# Altium project DCAV32_WINGLET_V1P_OSR.PrjPcb (part 1 of 3)
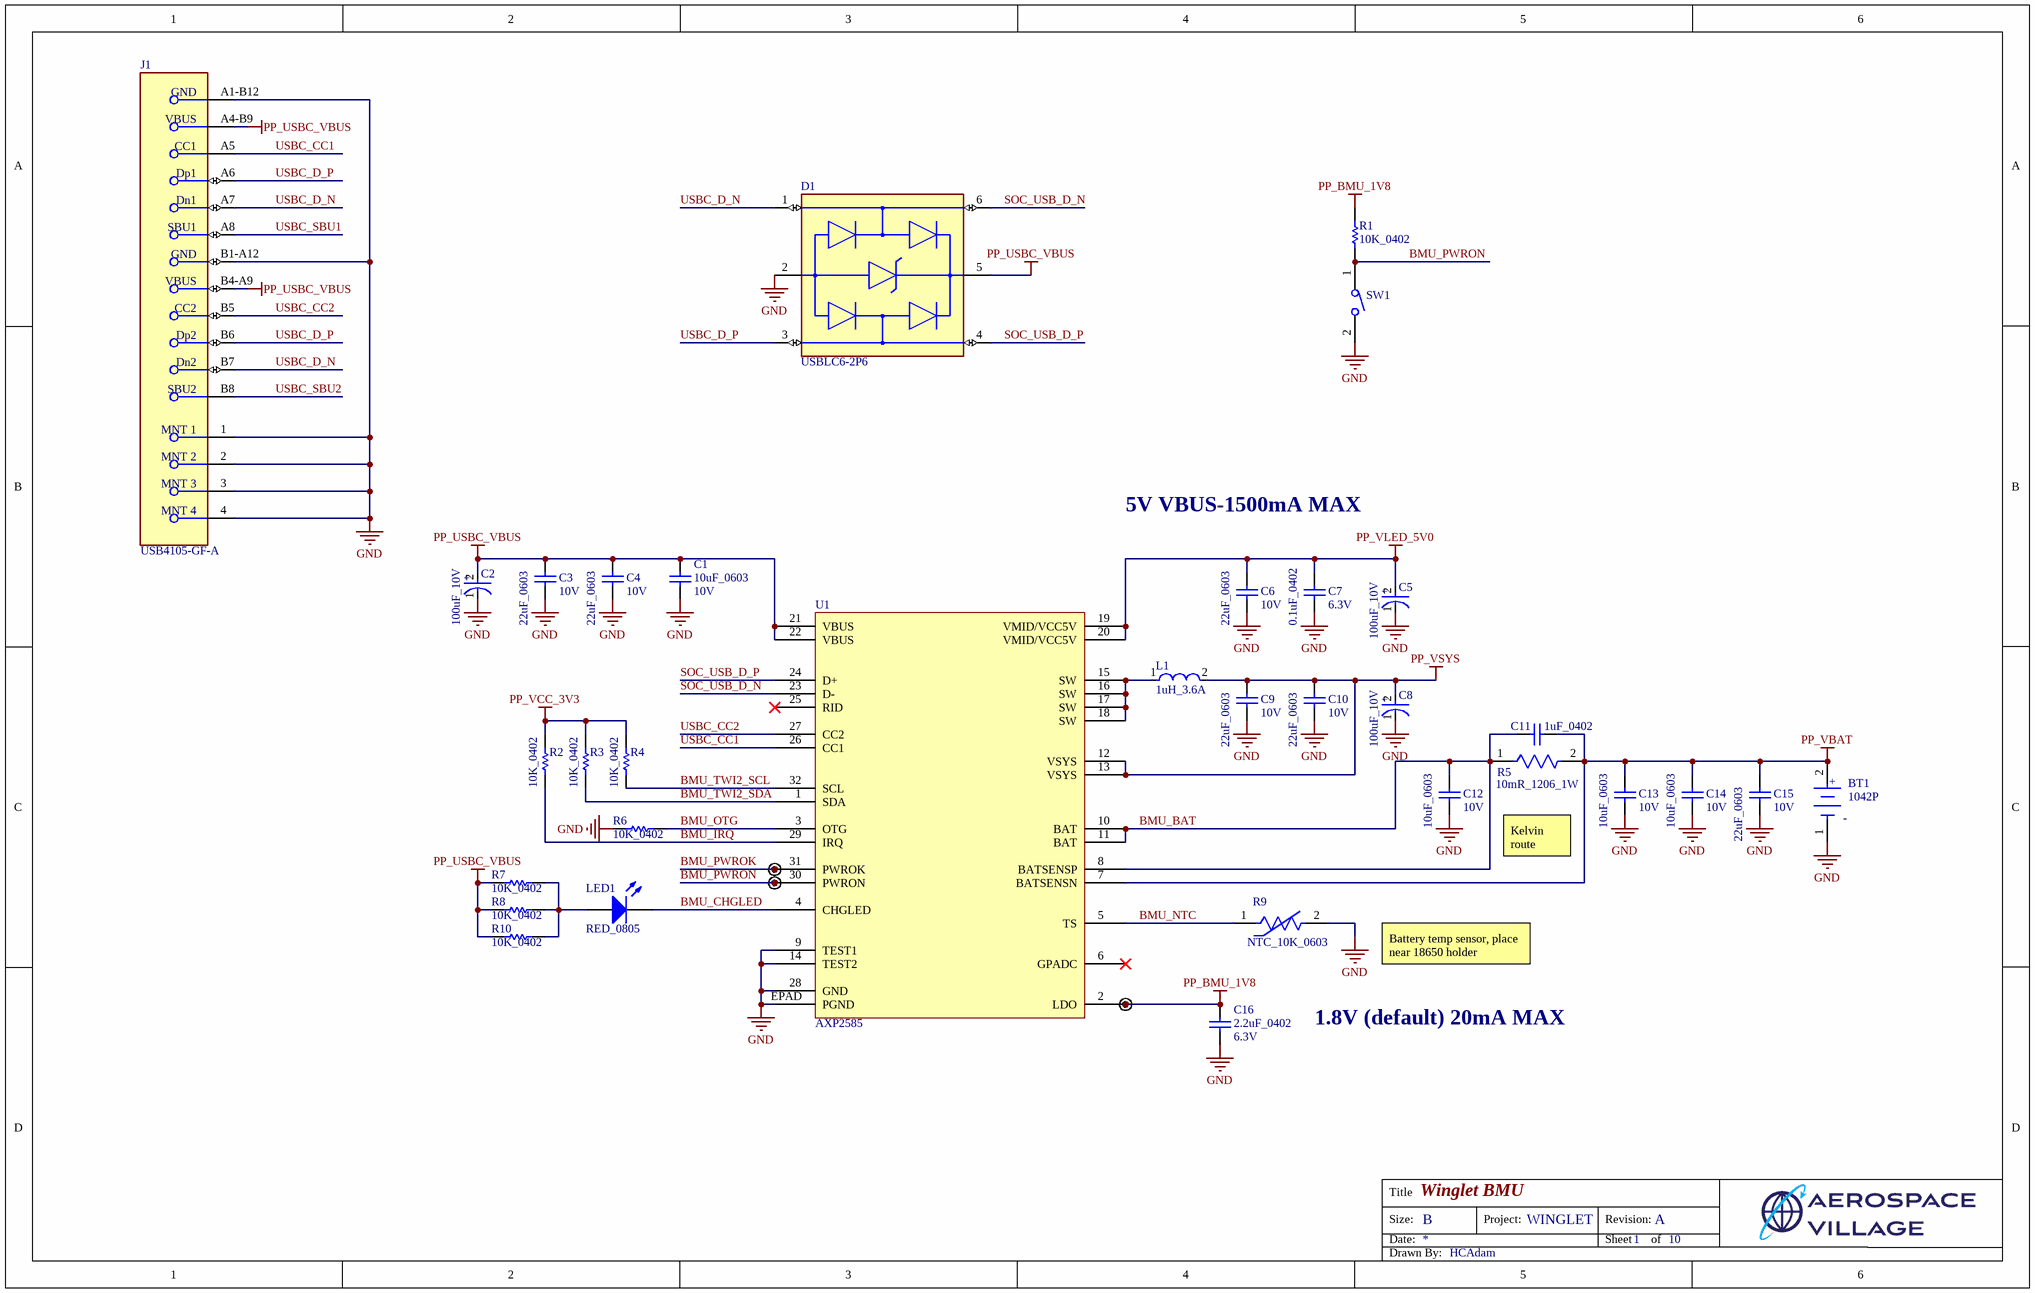
[diagram p0: SCH_WINGLET_BMU.SchDoc]
10 sheets, 401 parts. Net scope: global (net labels, ports and power ports of the same name join across sheets).
Board file: PCB_WINGLET_V1P_OSR.PcbDoc
Sheets:
  SCH_WINGLET_BMU.SchDoc
  SCH_WINGLET_PWR.SchDoc
  SCH_WINGLET_SOC.SchDoc
  SCH_WINGLET_SD_MMC.SchDoc
  SCH_WINGLET_DISP.SchDoc
  SCH_WINGLET_WIFI.SchDoc
  SCH_WINGLET_GNSS.SchDoc
  SCH_WINGLET_ADSB.SchDoc
  SCH_WINGLET_IO.SchDoc
  SCH_WINGLET_DEBUG.SchDoc

## Sheet SCH_WINGLET_BMU.SchDoc: Winglet BMU
size B; DrawnBy: HCAdam; Organization: Aerospace Village; DocumentNumber: WINGLET; Revision: A; SheetNumber: 1; SheetTotal: 10

### Parts
BT1  1042P  [FP-1042P-MFG]
C1  10uF_0603  Voltage Rating: 10V  [CAPC1609X100X15NL20]
C2  100uF_10V  [FP-TAJB-MFG]
C3  22uF_0603  Voltage Rating: 10V  [CAPC1608X100X20NL10]
C4  22uF_0603  Voltage Rating: 10V  [CAPC1608X100X20NL10]
C5  100uF_10V  [FP-TAJB-MFG]
C6  22uF_0603  Voltage Rating: 10V  [CAPC1608X100X20NL10]
C7  0.1uF_0402  Voltage Rating: 6.3V  [CAPC1005X56X25NL10T15]
C8  100uF_10V  [FP-TAJB-MFG]
C9  22uF_0603  Voltage Rating: 10V  [CAPC1608X100X20NL10]
C10  22uF_0603  Voltage Rating: 10V  [CAPC1608X100X20NL10]
C11  1uF_0402  [CAPC1005X55X25NL5T10]
C12  10uF_0603  Voltage Rating: 10V  [CAPC1609X100X15NL20]
C13  10uF_0603  Voltage Rating: 10V  [CAPC1609X100X15NL20]
C14  10uF_0603  Voltage Rating: 10V  [CAPC1609X100X15NL20]
C15  22uF_0603  Voltage Rating: 10V  [CAPC1608X100X20NL10]
C16  2.2uF_0402  Voltage Rating: 6.3V  [CAPC1005X55X25NL05T10]
D1  USBLC6-2P6  [FP-SOT-666-MFG]
J1  USB4105-GF-A  [FP-USB4105-GF-A-MFG]
L1  1uH_3.6A  [FP-NRS5020-MFG]
LED1  RED_0805  [0805_A]
R1  10K_0402  [RESC1005X40X25NL05T05]
R2  10K_0402  [RESC1005X40X25NL05T05]
R3  10K_0402  [RESC1005X40X25NL05T05]
R4  10K_0402  [RESC1005X40X25NL05T05]
R5  10mR_1206_1W  [FP-ERJ8BW-IPC_B]
R6  10K_0402  [RESC1005X40X25NL05T05]
R7  10K_0402  [RESC1005X40X25NL05T05]
R8  10K_0402  [RESC1005X40X25NL05T05]
R9  NTC_10K_0603  [FP-ERTJ1-IPC_C]
R10  10K_0402  [RESC1005X40X25NL05T05]
SW1  GT-TC029B-H025-L1N  [LCSC_SMD_SW_SMALL]  (value not drawn)
TP1  TESTPOINT  [TESTPOINT-0.7MM-SINGLE-LAYER]  (value not drawn)  (no BOM)
TP2  TESTPOINT  [TESTPOINT-0.7MM-SINGLE-LAYER]  (value not drawn)  (no BOM)
TP3  TESTPOINT  [TESTPOINT-0.7MM-SINGLE-LAYER]  (value not drawn)  (no BOM)
U1  AXP2585  [QFN127P600-8N]

### Nets
GND: BT1.1(C) C1.1 C2.1(C) C3.1 C4.1 C5.1(C) C6.1 C7.1 C8.1(C) C9.1 C10.1 C12.1 C13.1 C14.1 C15.1 C16.1 D1.2(GND) J1.1(MNT_1) J1.2(MNT_2) J1.3(MNT_3) J1.4(MNT_4) J1.A1-B12(GND) J1.B1-A12(GND) R6.1 R9.2 SW1.2 U1.9(TEST1) U1.14(TEST2) U1.28(GND) U1.EPAD(PGND)
PP_BMU_1V8: C16.2 R1.1 TP3.1 U1.2(LDO)
PP_USBC_VBUS: C1.2 C2.2(A) C3.2 C4.2 D1.5(VBUS) J1.A4-B9(VBUS) J1.B4-A9(VBUS) R7.2 R8.2 R10.2 U1.21(VBUS) U1.22(VBUS)
PP_VBAT: BT1.2(A) C11.1 C13.2 C14.2 C15.2 R5.2 U1.7(BATSENSN)
PP_VCC_3V3: R2.1 R3.1 R4.1
PP_VLED_5V0: C5.2(A) C6.2 C7.2 U1.19(VMID/VCC5V) U1.20(VMID/VCC5V)
PP_VSYS: C8.2(A) C9.2 C10.2 L1.2 U1.12(VSYS) U1.13(VSYS)
BMU_BAT: C11.2 C12.2 R5.1 U1.8(BATSENSP) U1.10(BAT) U1.11(BAT)
BMU_CHGLED: LED1.1(K) U1.4(CHGLED)
BMU_IRQ: R2.2 U1.29(IRQ)
BMU_NTC: R9.1 U1.5(TS)
BMU_OTG: R6.2 U1.3(OTG)
BMU_PWROK: TP1.1 U1.31(PWROK)
BMU_PWRON: R1.2 SW1.1 TP2.1 U1.30(PWRON)
BMU_TWI2_SCL: R4.2 U1.32(SCL)
BMU_TWI2_SDA: R3.2 U1.1(SDA)
SOC_USB_D_N: D1.6(I/O1) U1.23(D-)
SOC_USB_D_P: D1.4(I/O2) U1.24(D+)
USBC_CC1: J1.A5(CC1) U1.26(CC1)
USBC_CC2: J1.B5(CC2) U1.27(CC2)
USBC_D_N: D1.1(I/O1) J1.A7(Dn1) J1.B7(Dn2)
USBC_D_P: D1.3(I/O2) J1.A6(Dp1) J1.B6(Dp2)
USBC_SBU1: J1.A8(SBU1)
USBC_SBU2: J1.B8(SBU2)
NetL1_1: L1.1 U1.15(SW) U1.16(SW) U1.17(SW) U1.18(SW)
NetLED1_2: LED1.2(A) R7.1 R8.1 R10.1

Not connected (* = marked no-connect by the designer): U1 6(GPADC)* 25(RID)*

### Notes on the sheet
- 5V VBUS-1500mA MAX
- Kelvin route
- Battery temp sensor, place near 18650 holder
- 1.8V (default) 20mA MAX
- Title
- Size:
- Date:
- B
- Project:
- Revision:
- Sheet
- of
- Drawn By:
- (in symbol CMP-04424-000366-1) +
- (in symbol CMP-19636-000019-1) +; -

### Library data of the parts
BT1 = CMP-19636-000019-1: BATTERY HOLDER 18650 SMD TAB; Number of Cells: 1; Max Operating Temperature: 145°C; Termination: SMD/SMT; Mount: Surface Mount; Min Operating Temperature: -50°C; Package Quantity: 200; Packaging: Tray; Lead Free: Lead Free
C1 C12-C14 = CMP-2006-00191-1: Part Number: TACL106M006XTA; Manufacturer: AVX Interconnect / Elco
C2 C5 C8 = CMP-04424-000366-1: 100uF 10V ±10% 1.7Ω SMD CASE-B (3528) Tantalum Capacitor; Voltage Rating (DC): 6.3V; ESR (Equivalent Series Resistance): 1.7R; Polarity: Polar; Leakage Current: 6.3uA; Height: 1.9mm; Depth: 2.8mm; Length: 3.5mm; Min Operating Temperature: -55°C; Width: 2.8mm; Series: TAJ; Lead Free: Lead Free; Case/Package: 1210; Voltage: 6.3V; Mount: Surface Mount; Tolerance: 10%; Capacitance: 100uF; Radiation Hardening: No; REACH SVHC: No SVHC; Voltage Rating: 6.3V; Case Code (Metric): 3528; Dissipation Factor: 10%; Packaging: Tape and Reel; Construction: Flat; Features: General Purpose; Max Operating Temperature: 125°C; RoHS Compliant: Yes; Package Quantity: 1; Dielectric Material: Tantalum; Termination: SMD/SMT; Case Code (Imperial): 1210; Height - Seated (Max): 0.083inch
C3 C4 C6 C9 C10 C15 = CMP-2000-05441-1: Chip Capacitor, 22 uF, +/- 20%, 10 V, -55 to 85 degC, 0603 (1608 Metric), RoHS, Tape and Reel / PN: C1608X5R1A226M080AC; Manufacturer: TDK; PCN Part Number: MLCCPartNumberChange30/Nov/2012; Product Training Modules: CSeriesGeneralApplicationsSEAT,CCV,andTVCLDesignToolsGuidetoReplacinganElectrolyticCapacitorwithanMLCC; Other Names: 445-9077-1; Design Resources: 20WNon-IsolatedBuckLEDDriverUsingPLLNK460KG; Online Catalog: CSeries,GeneralPurpose; Capacitance: 22µF; Temperature Coefficient: X5R; Kits: 445-9014-KIT-ND-KITMLCC100PF-22UF060310-50V; Packaging: CutTape(CT); Standard Package: 1; Package / Case: 0603(1608Metric); Lead Style: -; Features: -; Ratings: -; Voltage - Rated: 10V; Operating Temperature: -55degC~85degC; Applications: GeneralPurpose; Package Reference: 603; Datasheet URL: http://download.siliconexpert.com/pdfs/2015/4/21/15/54/45/779/tdk_/manual/37024850441143360mlcc_commercial_general_en.pdf; Datasheet Version: Mar-15; Mounting Type: SurfaceMount,MLCC; Lead Spacing: -; Size / Dimension: 0.063"Lx0.031"W(1.60mmx0.80mm); Height - Seated (Max): -; Package Description: 2-Pin Surface Mount Device, Body 1.6 x 0.8 mm; Manufacturer URL: http://www.tdk.com/; RoHS Information: RoHSCertificate-MLCC; Tolerance: ±20%; Series: C; Thickness (Max): 0.035"(0.90mm); Family: CeramicCapacitors; Category: Capacitors
C7 = CMP-2008-02743-1: 04026D104KAT2A; Manufacturer: AVX Interconnect / Elco; Part Number: 04026D104KAT2A
C11 = CMP-1662-00020-1: Chip Capacitor, 1 uF, +/- 10%, 6.3 V, -55 to 85 degC, 0402 (1005 Metric), RoHS, Tape and Reel / GRM155R60J105KE19D; Voltage Rating (DC): 3 V; Type (Capacitors): X5R; Voltage Rating: 6.3 V; Capacitance: 1 uF; ComponentLink2Description: Datasheet; ComponentLink2URL: http://psearch.en.murata.com/capacitor/product/GRM155R60J105KE19%23.pdf; Max Operating Temperature: 85 degC; Min Operating Temperature: -55 degC; Package Quantity: 10000; Mounting Technology: Surface Mount; ComponentLink1Description: Manufacturer URL; ComponentLink1URL: http://www.murata.com/; PackageDescription: 2-Pin Surface Mount Device, Body 1 x 0.5 mm; Tolerance: 10%; Case/Package: 0402; Mount: Surface Mount; Packaging: Tape and Reel; Case Code (Metric): 1005; Radiation Hardening: No; Width: 0.5 mm; Length: 1 mm; DatasheetVersion: 08/2016; Height: 0.5 mm; PartNumber: GRM155R60J105KE19D; RoHSCompliant: true; Case Code (Imperial): 0402; REACH SVHC: No SVHC; Pins: 2
C16 = CMP-2008-04543-1: GRM155R60J225ME15D; Manufacturer: Murata; Part Number: GRM155R60J225ME15D
D1 = CMP-12225-000058-1: TVS DIODE 5.25V 17V SOT666; Min Breakdown Voltage: 6V; Power Line Protection: Yes; Element Configuration: Dual; Test Current: 1mA; Working Voltage: 5V; Number of Channels: 2; Max Reverse Leakage Current: 150nA; Direction: Unidirectional; Peak Pulse Current: 5A; Number of Elements: 1; Capacitance: 3.5pF; Max Breakdown Voltage: 6V; Height: 0.6mm; Depth: 1.3mm; Contact Plating: Tin; Reverse Breakdown Voltage: 6V; REACH SVHC: No SVHC; Operating Supply Voltage: 5V; Width: 1.3mm; Max Operating Temperature: 125°C; Reverse Standoff Voltage: 5V; ESD Protection: Yes; Package Quantity: 1; Termination: SMD/SMT; Length: 1.7mm; Leakage Current: 150nA; Number of Bidirectional Channels: 2; Case/Package: SOT-666; Min Operating Temperature: -40°C; Number of Pins: 6; Clamping Voltage: 17V; Breakdown Voltage: 6V; Lead Free: Lead Free; Radiation Hardening: No; Packaging: Tape and Reel; Mount: Surface Mount; Polarity: Unidirectional
J1 = CMP-245163-000001-1: CONN RCPT USB2.0 TYPEC 5A; Manufacturer: GCT; Voltage Rating: 20V; Is Female: yes; Current Rating: 5/6.25/1.25/0.25A; Number Of Contacts: 16; Conn Orientation: Right Angle; Device Class L1: Connectors; Category: Conn; Lead Free: Yes; RoHS: TRUE; Temperature Range High: +85°C; Digikey Description: CONN RCPT USB2.0 TYPEC 5A; Device Class L3: unset; ComponentLink2Description: Datasheet; Manufacturer Part Number: USB4105-GF-A; Package: 0; Usb Standard: USB 2.0; Device Class L2: USB Connectors; Automotive: No; Temperature Range Low: -40°C; Height: 3.46mm; Temperature: -40°C to +85°C; Contact Material: Gold,Nickel; ComponentLink2URL: https://gct.co/files/drawings/usb4105.pdf; Octopart: https://octopart.com/usb4105-gf-a-gct-106627878
L1 = CMP-14484-001289-1: Shielded Wirewound Inductor 1uH 30% 3.71A 25.2mΩ SMD / NRS5020T1R0NMGJ; RMS Current (Irms): 3.6A; Test Frequency: 100kHz; Core Material: Ferrite; DC Resistance (DCR): 25.2mR; Saturation Current: 4A; Self Resonant Frequency: 81MHz; Inductance: 1uH; Lead Free: Lead Free; Length: 4.9mm; Height - Seated (Max): 0.079inch; Max Operating Temperature: 125°C; Tolerance: 30%; Packaging: Tape and Reel; Halogen Free: Halogen Free; Mount: Surface Mount; Package Quantity: 800; Current Rating: 3.6A; RoHS Compliant: Yes; Resistor Type: Wirewound; Radiation Hardening: No; Min Operating Temperature: -25°C; Inductance Tolerance: 30%; Width: 0.193inch; Lead Pitch: 3.3mm; Series: NRS; Max DC Current: 4A; Number of Pins: 2; Case/Package: 5020; Depth: 5.1mm; Termination: SMD/SMT; Shielding: Shielded; Height: 2mm
LED1 = CMP-1426-00007-1: LED RED 0805; PartNumber: 150080GS75000; Manufacturer: Wuerth Elektronik; Color: Green; PackageReference: 0805_A; ComponentLink2URL: http://katalog.we-online.com/led/datasheet/150080GS75000.pdf; ComponentLink1URL: http://www.we-online.com; ComponentLink1Description: Manufacturer URL; ComponentLink2Description: Datasheet
R1-R4 R6-R8 R10 = CMP-2000-07588-1: Chip Resistor, 10 KOhm, +/- 1%, 0.1 W, -55 to 155 degC, 0402 (1005 Metric), RoHS, Tape and Reel / ERJ2RKF1002X; Manufacturer: Panasonic; Power Rating: 100mW; Voltage Rating: 50V; Resistance: 10KOhm; Case\/Package: 0402; Temperature Coefficient: 100ppm\/degreesC; RoHSCompliant: True; Lead Free: LeadFree; Package Quantity: 1; Contact Plating: Tin; Length: 1mm; Radiation Hardening: No; REACH SVHC: NoSVHC; Max Operating Temperature: 155degC; Depth: 0.5mm; Case Code (Imperial): 0402; Military Standard: Not; Package Description: 2-Pin Surface Mount Device, Body 1 x 0.5 mm; Termination: SMD/SMT; Case Code (Metric): 1005; Height: 0.35mm; Packaging: TapeandReel; Voltage Rating (DC): 50V; Package Reference: 402; Number of Pins: 2; Tolerance: 1%; Mounting Technology: SurfaceMount; Width: 0.02inch; Mount: SurfaceMount; Datasheet URL: https://industrial.panasonic.com/cdbs/www-data/pdf/RDA0000/AOA0000C304.pdf; Composition: ThickFilm; Datasheet Version: 02/2017; Manufacturer URL: http://www.panasonic.com/; Max Power Dissipation: 100mW; Number of Terminations: 2; Min Operating Temperature: -55degC
R5 = CMP-2003-00764-2: RES 0.01 OHM 1% 1W 1206 / ERJ-8BWFR010V; Temperature Coefficient: 200ppm/°C; Resistance: 10mR; Mount: Surface Mount; Package Quantity: 1; Construction: Rectangular; Technology: THICK FILM; Contact Plating: Tin; Length: 3.2mm; Features: Automotive AEC-Q200; Lead Free: Lead Free; Military Standard: Not; Resistance Tolerance: 1%; Case/Package: 1206; Width: 1.6mm; Case Code (Imperial): 1206; Max Operating Temperature: 155°C; Min Operating Temperature: -55°C; Max Power Dissipation: 1W; Tolerance: 1%; Height: 0.65mm; Termination: SMD/SMT; REACH SVHC: No SVHC; Radiation Hardening: No; Depth: 1.6mm; Series: ERJ; RoHS Compliant: Yes; Packaging: Tape and Reel; Number of Terminations: 2; Resistor Type: Thick Film; Size Code: 1206; Power Rating: 1W; Case Code (Metric): 3216
R9 = CMP-05419-000002-1: THERMISTOR NTC 10KOHM 3380K 0603 / ERT-J1VG103JA; Tolerance: 5%; Resistance: 10kR; Max Power Dissipation: 100mW; Accuracy: 1%; Case Code (Metric): 1608; Lead Free: Lead Free; Max Operating Temperature: 125°C; Termination: SMD/SMT; Radiation Hardening: No; Series: ERT-J; Length: 1.6mm; Depth: 0.8mm; RoHS Compliant: Yes; Number of Pins: 2; Case/Package: 0603; Packaging: Tape and Reel; Width: 800um; REACH SVHC: No SVHC; Min Operating Temperature: -40°C; Package Quantity: 4000; Case Code (Imperial): 0603; Resistance Tolerance: 5%; Mount: Surface Mount
SW1 = GT-TC029B-H025-L1N: SMD SPST Tactile Switch / C843669
TP1-TP3 = TP_07: TESTPOINT SINGLE LAYER 0.7MM; AEC-Q: Yes; PPAP: Unknown; Selective Soldering: No; Value: Unknown; RoHS: Yes; Package: BOARD_FEATURE; Washable: Yes; Mounting: Unknown
U1 = AXP2585: AXP2585 Single Cell NVDC BMU with E-gauge

## Sheet SCH_WINGLET_PWR.SchDoc: Winglet Power Supply
size B; DrawnBy: HCAdam; Organization: Aerospace Village; DocumentNumber: WINGLET; Revision: A; SheetNumber: 2; SheetTotal: 10
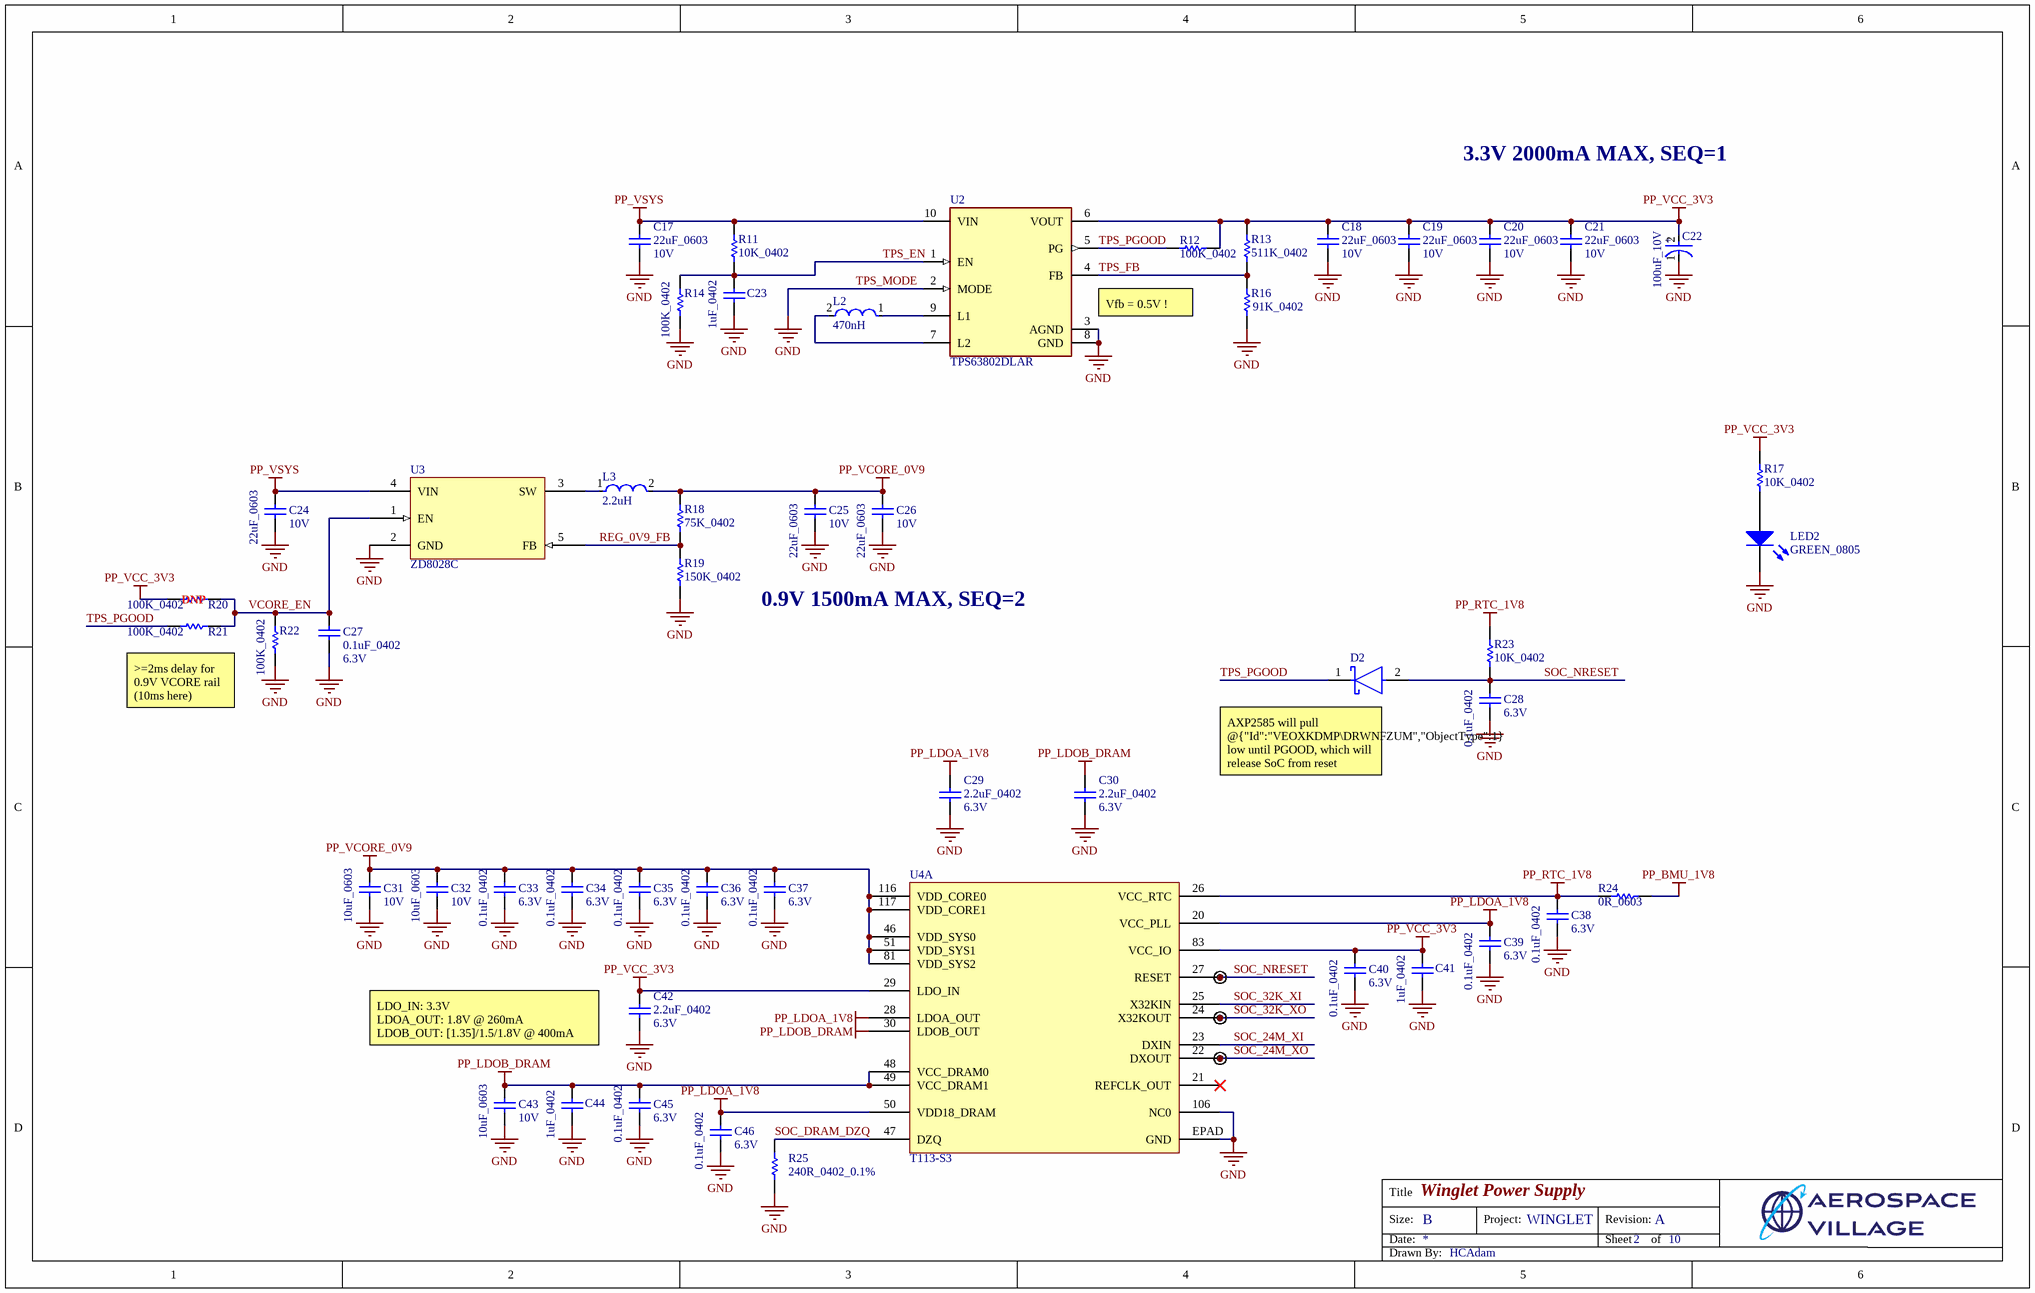
[diagram p1: SCH_WINGLET_PWR.SchDoc]

### Parts
C17  22uF_0603  Voltage Rating: 10V  [CAPC1608X100X20NL10]
C18  22uF_0603  Voltage Rating: 10V  [CAPC1608X100X20NL10]
C19  22uF_0603  Voltage Rating: 10V  [CAPC1608X100X20NL10]
C20  22uF_0603  Voltage Rating: 10V  [CAPC1608X100X20NL10]
C21  22uF_0603  Voltage Rating: 10V  [CAPC1608X100X20NL10]
C22  100uF_10V  [FP-TAJB-MFG]
C23  1uF_0402  [CAPC1005X55X25NL5T10]
C24  22uF_0603  Voltage Rating: 10V  [CAPC1608X100X20NL10]
C25  22uF_0603  Voltage Rating: 10V  [CAPC1608X100X20NL10]
C26  22uF_0603  Voltage Rating: 10V  [CAPC1608X100X20NL10]
C27  0.1uF_0402  Voltage Rating: 6.3V  [CAPC1005X56X25NL10T15]
C28  0.1uF_0402  Voltage Rating: 6.3V  [CAPC1005X56X25NL10T15]
C29  2.2uF_0402  Voltage Rating: 6.3V  [CAPC1005X55X25NL05T10]
C30  2.2uF_0402  Voltage Rating: 6.3V  [CAPC1005X55X25NL05T10]
C31  10uF_0603  Voltage Rating: 10V  [CAPC1609X100X15NL20]
C32  10uF_0603  Voltage Rating: 10V  [CAPC1609X100X15NL20]
C33  0.1uF_0402  Voltage Rating: 6.3V  [CAPC1005X56X25NL10T15]
C34  0.1uF_0402  Voltage Rating: 6.3V  [CAPC1005X56X25NL10T15]
C35  0.1uF_0402  Voltage Rating: 6.3V  [CAPC1005X56X25NL10T15]
C36  0.1uF_0402  Voltage Rating: 6.3V  [CAPC1005X56X25NL10T15]
C37  0.1uF_0402  Voltage Rating: 6.3V  [CAPC1005X56X25NL10T15]
C38  0.1uF_0402  Voltage Rating: 6.3V  [CAPC1005X56X25NL10T15]
C39  0.1uF_0402  Voltage Rating: 6.3V  [CAPC1005X56X25NL10T15]
C40  0.1uF_0402  Voltage Rating: 6.3V  [CAPC1005X56X25NL10T15]
C41  1uF_0402  [CAPC1005X55X25NL5T10]
C42  2.2uF_0402  Voltage Rating: 6.3V  [CAPC1005X55X25NL05T10]
C43  10uF_0603  Voltage Rating: 10V  [CAPC1609X100X15NL20]
C44  1uF_0402  [CAPC1005X55X25NL5T10]
C45  0.1uF_0402  Voltage Rating: 6.3V  [CAPC1005X56X25NL10T15]
C46  0.1uF_0402  Voltage Rating: 6.3V  [CAPC1005X56X25NL10T15]
D2  BAT54KFILM  [FP-SOD-523-MFG]  (value not drawn)
L2  470nH  [FP-DFE252012C-IPC_A]
L3  2.2uH  [FP-NR3015-MFG]
LED2  GREEN_0805  [0805_A]
R11  10K_0402  [RESC1005X40X25NL05T05]
R12  100K_0402  [RESC1005X40X25NL05T10]
R13  511K_0402  [RESC1005X40X25NL05T10]
R14  100K_0402  [RESC1005X40X25NL05T10]
R16  91K_0402  [RESC1005X40X25NL05T10]
R17  10K_0402  [RESC1005X40X25NL05T05]
R18  75K_0402  [RESC1005X40X25NL05T05]
R19  150K_0402  [RESC1005X40X25NL05T05]
R20  100K_0402  [RESC1005X40X25NL05T10]
R21  100K_0402  [RESC1005X40X25NL05T10]
R22  100K_0402  [RESC1005X40X25NL05T10]
R23  10K_0402  [RESC1005X40X25NL05T05]
R24  0R_0603  [RESC1608X55X25LL10T15]
R25  240R_0402_0.1%  [RESC1005X40X25NL05T05]
TP4  TESTPOINT  [TESTPOINT-0.7MM-SINGLE-LAYER]  (value not drawn)  (no BOM)
TP5  TESTPOINT  [TESTPOINT-0.7MM-SINGLE-LAYER]  (value not drawn)  (no BOM)
TP6  TESTPOINT  [TESTPOINT-0.7MM-SINGLE-LAYER]  (value not drawn)  (no BOM)
U2  TPS63802DLAR  [FP-DLA0010A-MFG]
U3  ZD8028C  [SOT95P292X115-5N]
U4  T113-S3  [TSQFP40P1600X1600X160_HS-129N]  (part A of 7)

### Nets
GND: C17.1 C18.1 C19.1 C20.1 C21.1 C22.1(C) C23.1 C24.1 C25.1 C26.1 C27.1 C28.1 C29.1 C30.1 C31.1 C32.1 C33.1 C34.1 C35.1 C36.1 C37.1 C38.1 C39.1 C40.1 C41.1 C42.1 C43.1 C44.1 C45.1 C46.1 LED2.1(K) R14.2 R16.2 R19.1 R22.2 R25.1 U2.2(MODE) U2.3(AGND) U2.8(GND) U3.2(GND) U4.106(NC0) U4.EPAD(GND)  [also labelled TPS_MODE]
PP_BMU_1V8: R24.2
PP_LDOA_1V8: C29.2 C39.2 C46.2 U4.20(VCC_PLL) U4.28(LDOA_OUT) U4.50(VDD18_DRAM)
PP_LDOB_DRAM: C30.2 C43.2 C44.2 C45.2 U4.30(LDOB_OUT) U4.48(VCC_DRAM0) U4.49(VCC_DRAM1)
PP_RTC_1V8: C38.2 R23.2 R24.1 U4.26(VCC_RTC)
PP_VCC_3V3: C18.2 C19.2 C20.2 C21.2 C22.2(A) C40.2 C41.2 C42.2 R12.2 R13.1 R17.2 R20.2 U2.6(VOUT) U4.29(LDO_IN) U4.83(VCC_IO)
PP_VCORE_0V9: C25.2 C26.2 C31.2 C32.2 C33.2 C34.2 C35.2 C36.2 C37.2 L3.2 R18.2 U4.46(VDD_SYS0) U4.51(VDD_SYS1) U4.81(VDD_SYS2) U4.116(VDD_CORE0) U4.117(VDD_CORE1)
PP_VSYS: C17.2 C24.2 R11.1 U2.10(VIN) U3.4(VIN)
REG_0V9_FB: R18.1 R19.2 U3.5(FB)
SOC_24M_XI: U4.23(DXIN)
SOC_24M_XO: TP6.1 U4.22(DXOUT)
SOC_32K_XI: U4.25(X32KIN)
SOC_32K_XO: TP5.1 U4.24(X32KOUT)
SOC_DRAM_DZQ: R25.2 U4.47(DZQ)
SOC_NRESET: C28.2 D2.2(A) R23.1 TP4.1 U4.27(RESET)
TPS_EN: C23.2 R11.2 R14.1 U2.1(EN)
TPS_FB: R13.2 R16.1 U2.4(FB)
TPS_PGOOD: D2.1(C) R12.1 R21.2 U2.5(PG)
VCORE_EN: C27.2 R20.1 R21.1 R22.1 U3.1(EN)
NetL2_1: L2.1 U2.9(L1)
NetL2_2: L2.2 U2.7(L2)
NetL3_1: L3.1 U3.3(SW)
NetLED2_2: LED2.2(A) R17.1

Not connected (* = marked no-connect by the designer): U4 21(REFCLK_OUT)*

### Notes on the sheet
- 3.3V 2000mA MAX, SEQ=1
- Vfb = 0.5V !
- 0.9V 1500mA MAX, SEQ=2
- >=2ms delay for 0.9V VCORE rail (10ms here)
- (near D2) AXP2585 will pull @{"Id":"VEOXKDMP\DRWNFZUM","ObjectType":1} low until PGOOD, which will release SoC from reset
- LDO_IN: 3.3V
  LDOA_OUT: 1.8V @ 260mA
  LDOB_OUT: [1.35]/1.5/1.8V @ 400mA
- Title
- Size:
- Date:
- B
- Project:
- Revision:
- Sheet
- of
- Drawn By:
- (in symbol CMP-04424-000366-1) +

### Library data of the parts
C17-C21 C24-C26 = CMP-2000-05441-1: as C3 on sheet SCH_WINGLET_BMU; Packaging: CutTape(CT); Standard Package: 1; Package / Case: 0603(1608Metric); Lead Style: -; Features: -; Ratings: -; Voltage - Rated: 10V; Operating Temperature: -55degC~85degC; Applications: GeneralPurpose; Package Reference: 603; Datasheet URL: http://download.siliconexpert.com/pdfs/2015/4/21/15/54/45/779/tdk_/manual/37024850441143360mlcc_commercial_general_en.pdf; Datasheet Version: Mar-15; Mounting Type: SurfaceMount,MLCC; Lead Spacing: -; Size / Dimension: 0.063"Lx0.031"W(1.60mmx0.80mm); Height - Seated (Max): -; Package Description: 2-Pin Surface Mount Device, Body 1.6 x 0.8 mm; Manufacturer URL: http://www.tdk.com/; RoHS Information: RoHSCertificate-MLCC; Tolerance: ±20%; Series: C; Thickness (Max): 0.035"(0.90mm); Family: CeramicCapacitors; Category: Capacitors
C22 = CMP-04424-000366-1: as C2 on sheet SCH_WINGLET_BMU; Height: 1.9mm; Depth: 2.8mm; Length: 3.5mm; Min Operating Temperature: -55°C; Width: 2.8mm; Series: TAJ; Lead Free: Lead Free; Case/Package: 1210; Voltage: 6.3V; Mount: Surface Mount; Tolerance: 10%; Capacitance: 100uF; Radiation Hardening: No; REACH SVHC: No SVHC; Voltage Rating: 6.3V; Case Code (Metric): 3528; Dissipation Factor: 10%; Packaging: Tape and Reel; Construction: Flat; Features: General Purpose; Max Operating Temperature: 125°C; RoHS Compliant: Yes; Package Quantity: 1; Dielectric Material: Tantalum; Termination: SMD/SMT; Case Code (Imperial): 1210; Height - Seated (Max): 0.083inch
C23 C41 C44 = CMP-1662-00020-1: as C11 on sheet SCH_WINGLET_BMU; ComponentLink2Description: Datasheet; ComponentLink2URL: http://psearch.en.murata.com/capacitor/product/GRM155R60J105KE19%23.pdf; Max Operating Temperature: 85 degC; Min Operating Temperature: -55 degC; Package Quantity: 10000; Mounting Technology: Surface Mount; ComponentLink1Description: Manufacturer URL; ComponentLink1URL: http://www.murata.com/; PackageDescription: 2-Pin Surface Mount Device, Body 1 x 0.5 mm; Tolerance: 10%; Case/Package: 0402; Mount: Surface Mount; Packaging: Tape and Reel; Case Code (Metric): 1005; Radiation Hardening: No; Width: 0.5 mm; Length: 1 mm; DatasheetVersion: 08/2016; Height: 0.5 mm; PartNumber: GRM155R60J105KE19D; RoHSCompliant: true; Case Code (Imperial): 0402; REACH SVHC: No SVHC; Pins: 2
C27 C28 C33-C40 C45 C46 = CMP-2008-02743-1: as C7 on sheet SCH_WINGLET_BMU; Part Number: 04026D104KAT2A
C29 C30 C42 = CMP-2008-04543-1: GRM155R60J225ME15D; Manufacturer: Murata; Part Number: GRM155R60J225ME15D
C31 C32 C43 = CMP-2006-00191-1: as C1 on sheet SCH_WINGLET_BMU
D2 = CMP-12187-000026-1: DIODE SCHOTTKY 40V 300MA SOD523; Manufacturer: STMicroelectronics; Capacitance: 7pF; Value: 7pF; Max Surge Forward Current: 1.25A; Peak Reverse Current: 1uA; Max Junction Temp: +150°C; Device Class L2: Diodes; Temperature Range Low: -40°C; Category: Diode; Manufacturer Part Number: BAT54KFILM; Digikey Description: DIODE SCHOTTKY 40V 300MA SOD523; Device Class L3: Schottky Diodes; Automotive: No; Height: 0.7mm; Octopart: https://octopart.com/bat54kfilm-stmicroelectronics-39618022; ComponentLink2Description: Datasheet; Temperature Range High: +150°C; Device Class L1: Discrete Semiconductors; Max Repetitive Reverse Voltage: 40V; RoHS: TRUE; Temperature: -40°C to +150°C; ComponentLink2URL: https://www.st.com/content/ccc/resource/technical/document/datasheet/07/50/54/f2/0d/ba/4a/79/CD00001322.pdf/files/CD00001322.pdf/jcr:content/translations/en.CD00001322.pdf; Lead Free: Yes; Forward Current: 300mA; Package: SOD-523; Mouser Description: Schottky Diodes & Rectifiers schottky diode
L2 = CMP-06042-015149-1: Shielded Wirewound Inductor 0.47uH 20% 4000mA 0.027Ω 1008 (2520) / DFE252012PD-R47M
L3 = CMP-0569-00001-3: SMD Power Inductors 2.2uH ±20% 1.48A 72mΩ / NR3015T2R2M; RMS Current (Irms): 1.5A; Shielding: Shielded; Self Resonant Frequency: 64MHz; Test Frequency: 100kHz; DC Resistance (DCR): 72mR; Core Material: Ferrite; Package Quantity: 1; Current Rating: 1.48A; Height - Seated (Max): 0.059inch; Width: 0.118inch; Inductance Tolerance: 20%; Tolerance: 20%; Resistor Type: Wirewound; RoHS Compliant: Yes; Case/Package: 3015; Length: 0.118inch; Max DC Current: 1.5A; Max Operating Temperature: 120°C; Inductance: 2.2uH; Saturation Current: 1.48A; Min Operating Temperature: -25°C; Height: 1.5mm; Series: NR; Lead Free: Lead Free; Packaging: Tape and Reel; Halogen Free: Halogen Free; Termination: SMD/SMT; Number of Pins: 2
LED2 = CMP-1426-00007-1: SMD mono-color Chip LED, WL-SMCW, Green / 150080GS75000; Manufacturer: Wuerth Elektronik; PackageReference: 0805_A; Color: Green; PartNumber: 150080GS75000; ComponentLink2URL: http://katalog.we-online.com/led/datasheet/150080GS75000.pdf; ComponentLink1URL: http://www.we-online.com; ComponentLink1Description: Manufacturer URL; ComponentLink2Description: Datasheet
R11 R17 R23 = CMP-2000-07588-1: as R1 on sheet SCH_WINGLET_BMU; RoHSCompliant: True; Lead Free: LeadFree; Package Quantity: 1; Contact Plating: Tin; Length: 1mm; Radiation Hardening: No; REACH SVHC: NoSVHC; Max Operating Temperature: 155degC; Depth: 0.5mm; Case Code (Imperial): 0402; Military Standard: Not; Package Description: 2-Pin Surface Mount Device, Body 1 x 0.5 mm; Termination: SMD/SMT; Case Code (Metric): 1005; Height: 0.35mm; Packaging: TapeandReel; Voltage Rating (DC): 50V; Package Reference: 402; Number of Pins: 2; Tolerance: 1%; Mounting Technology: SurfaceMount; Width: 0.02inch; Mount: SurfaceMount; Datasheet URL: https://industrial.panasonic.com/cdbs/www-data/pdf/RDA0000/AOA0000C304.pdf; Composition: ThickFilm; Datasheet Version: 02/2017; Manufacturer URL: http://www.panasonic.com/; Max Power Dissipation: 100mW; Number of Terminations: 2; Min Operating Temperature: -55degC
R12-R14 R16 R20-R22 = CMP-2002-07343-1: RC0402FR-07100KL; Manufacturer: Yageo / Phycomp; Part Number: RC0402FR-07100KL
  R20: DNP: DNP
R18 = CMP-2000-07588-1: Manufacturer: Panasonic; Power Rating: 100mW; Voltage Rating: 50V; Resistance: 10KOhm; Tolerance: 1%; Case\/Package: 0402; Temperature Coefficient: 100ppm\/degreesC; RoHSCompliant: True; Lead Free: LeadFree; Package Quantity: 1; Contact Plating: Tin; Length: 1mm; Radiation Hardening: No; REACH SVHC: NoSVHC; Max Operating Temperature: 155degC; Depth: 0.5mm; Case Code (Imperial): 0402; Military Standard: Not; Package Description: 2-Pin Surface Mount Device, Body 1 x 0.5 mm; Termination: SMD/SMT; Case Code (Metric): 1005; Height: 0.35mm; Packaging: TapeandReel; Voltage Rating (DC): 50V; Package Reference: 402; Number of Pins: 2; Mounting Technology: SurfaceMount; Width: 0.02inch; Mount: SurfaceMount; Datasheet URL: https://industrial.panasonic.com/cdbs/www-data/pdf/RDA0000/AOA0000C304.pdf; Composition: ThickFilm; Datasheet Version: 02/2017; Manufacturer URL: http://www.panasonic.com/; Max Power Dissipation: 100mW; Number of Terminations: 2; Min Operating Temperature: -55degC
R19 = CMP-2000-07588-1: RC0402FR-07150KL; Manufacturer: Panasonic; Power Rating: 100mW; Voltage Rating: 50V; Resistance: 10KOhm; Tolerance: 1%; Case\/Package: 0402; Temperature Coefficient: 100ppm\/degreesC; RoHSCompliant: True; Lead Free: LeadFree; Package Quantity: 1; Contact Plating: Tin; Length: 1mm; Radiation Hardening: No; REACH SVHC: NoSVHC; Max Operating Temperature: 155degC; Depth: 0.5mm; Case Code (Imperial): 0402; Military Standard: Not; Package Description: 2-Pin Surface Mount Device, Body 1 x 0.5 mm; Termination: SMD/SMT; Case Code (Metric): 1005; Height: 0.35mm; Packaging: TapeandReel; Voltage Rating (DC): 50V; Package Reference: 402; Number of Pins: 2; Mounting Technology: SurfaceMount; Width: 0.02inch; Mount: SurfaceMount; Datasheet URL: https://industrial.panasonic.com/cdbs/www-data/pdf/RDA0000/AOA0000C304.pdf; Composition: ThickFilm; Datasheet Version: 02/2017; Manufacturer URL: http://www.panasonic.com/; Max Power Dissipation: 100mW; Number of Terminations: 2; Min Operating Temperature: -55degC
R24 = CMP-2000-04300-1: RC0603JR-100RL; Manufacturer: Yageo; Part Number: RC0603JR-100RL
R25 = CMP-1665-00034-1: Chip Resistor, 240 Ohm, +/- 1%, 100 mW, -55 to 155 degC, 0402 (1005 Metric), RoHS, Tape and Reel, ERJ-2RKF2400X; Voltage Rating: 50 V; Resistance: 240 Ohm; Case\/Package: 0402; Power Rating: 100 mW; Package Quantity: 10000; Length: 1 mm; PackageDescription: 2-Pin Surface Mount Device, Body 1 x 0.5 mm; Packaging: Tape and Reel; Tolerance: 1%; REACH SVHC: Unknown; ComponentLink1URL: http://www.panasonic.com/; Radiation Hardening: No; Height: 0.35 mm; Mounting Technology: Surface Mount; ComponentLink2Description: Datasheet; Width: 0.5 mm; ComponentLink2URL: http://industrial.panasonic.com/cdbs/www-data/pdf/RDA0000/AOA0000C86.pdf; PartNumber: ERJ-2RKF2400X; PackageReference: 0402; Case Code (Imperial): 0402; Case Code (Metric): 1005; ComponentLink1Description: Manufacturer URL; Mount: Surface Mount; RoHSCompliant: true; Max Operating Temperature: 155 degC; DatasheetVersion: 04/2015; Min Operating Temperature: -55 degC; Pins: 2; DNP: DNP
TP4-TP6 = TP_07: as TP1 on sheet SCH_WINGLET_BMU; RoHS: Yes; Package: BOARD_FEATURE; Washable: Yes; Mounting: Unknown
U2 = CMP-04918-000005-1: IC POWER MANAGEMENT; Manufacturer: Texas Instruments; Nominal Supply Current: 11uA; Max Junction Temp: +125°C; Max Supply Voltage: 5.5V; Switching Topology: Buck-Boost; Min Supply Voltage: 1.3V; Output Current: 2A; Output Voltage: 1.8-5.2V; Number Of Outputs: 1; Switching Frequency: 1.4/1.6/2.1MHz; Standoff Height: 0mm; Max Duty Cycle: 100%; Output Type: AdjustableProgrammable; Manufacturer Part Number: TPS63802DLAR; ComponentLink2URL: https://www.ti.com/lit/ds/symlink/tps63802.pdf; Digikey Description: IC POWER MANAGEMENT; Octopart: https://octopart.com/tps63802dlar-texas+instruments-97359678; Height: 1mm; Temperature: -40°C to +125°C; Device Class L3: Voltage Regulators - Switching; Lead Free: Yes; Category: IC; Mouser Description: 2-A, high-efficient, 11-µA quiescent current buck-boost converter in QFN/DFN package 10-VSON-HR -40 to 125; ComponentLink2Description: Datasheet; Temperature Range Low: -40°C; Temperature Range High: +125°C; Automotive: No; Device Class L2: Power Management ICs; RoHS: TRUE; Device Class L1: Integrated Circuits (ICs); Package: DLA0010A
U3 = ZD8028C: 1.5A 2MHz 5.5V Synchronous Buck Converter
U4 = T113-S3: Allwinner Dual-core ARM Cortex-A7 Smart Control and Display SoC

## Sheet SCH_WINGLET_SOC.SchDoc: Winglet T113 SOC
size B; DrawnBy: HCAdam; Organization: Aerospace Village; DocumentNumber: WINGLET; Revision: A; SheetNumber: 3; SheetTotal: 10
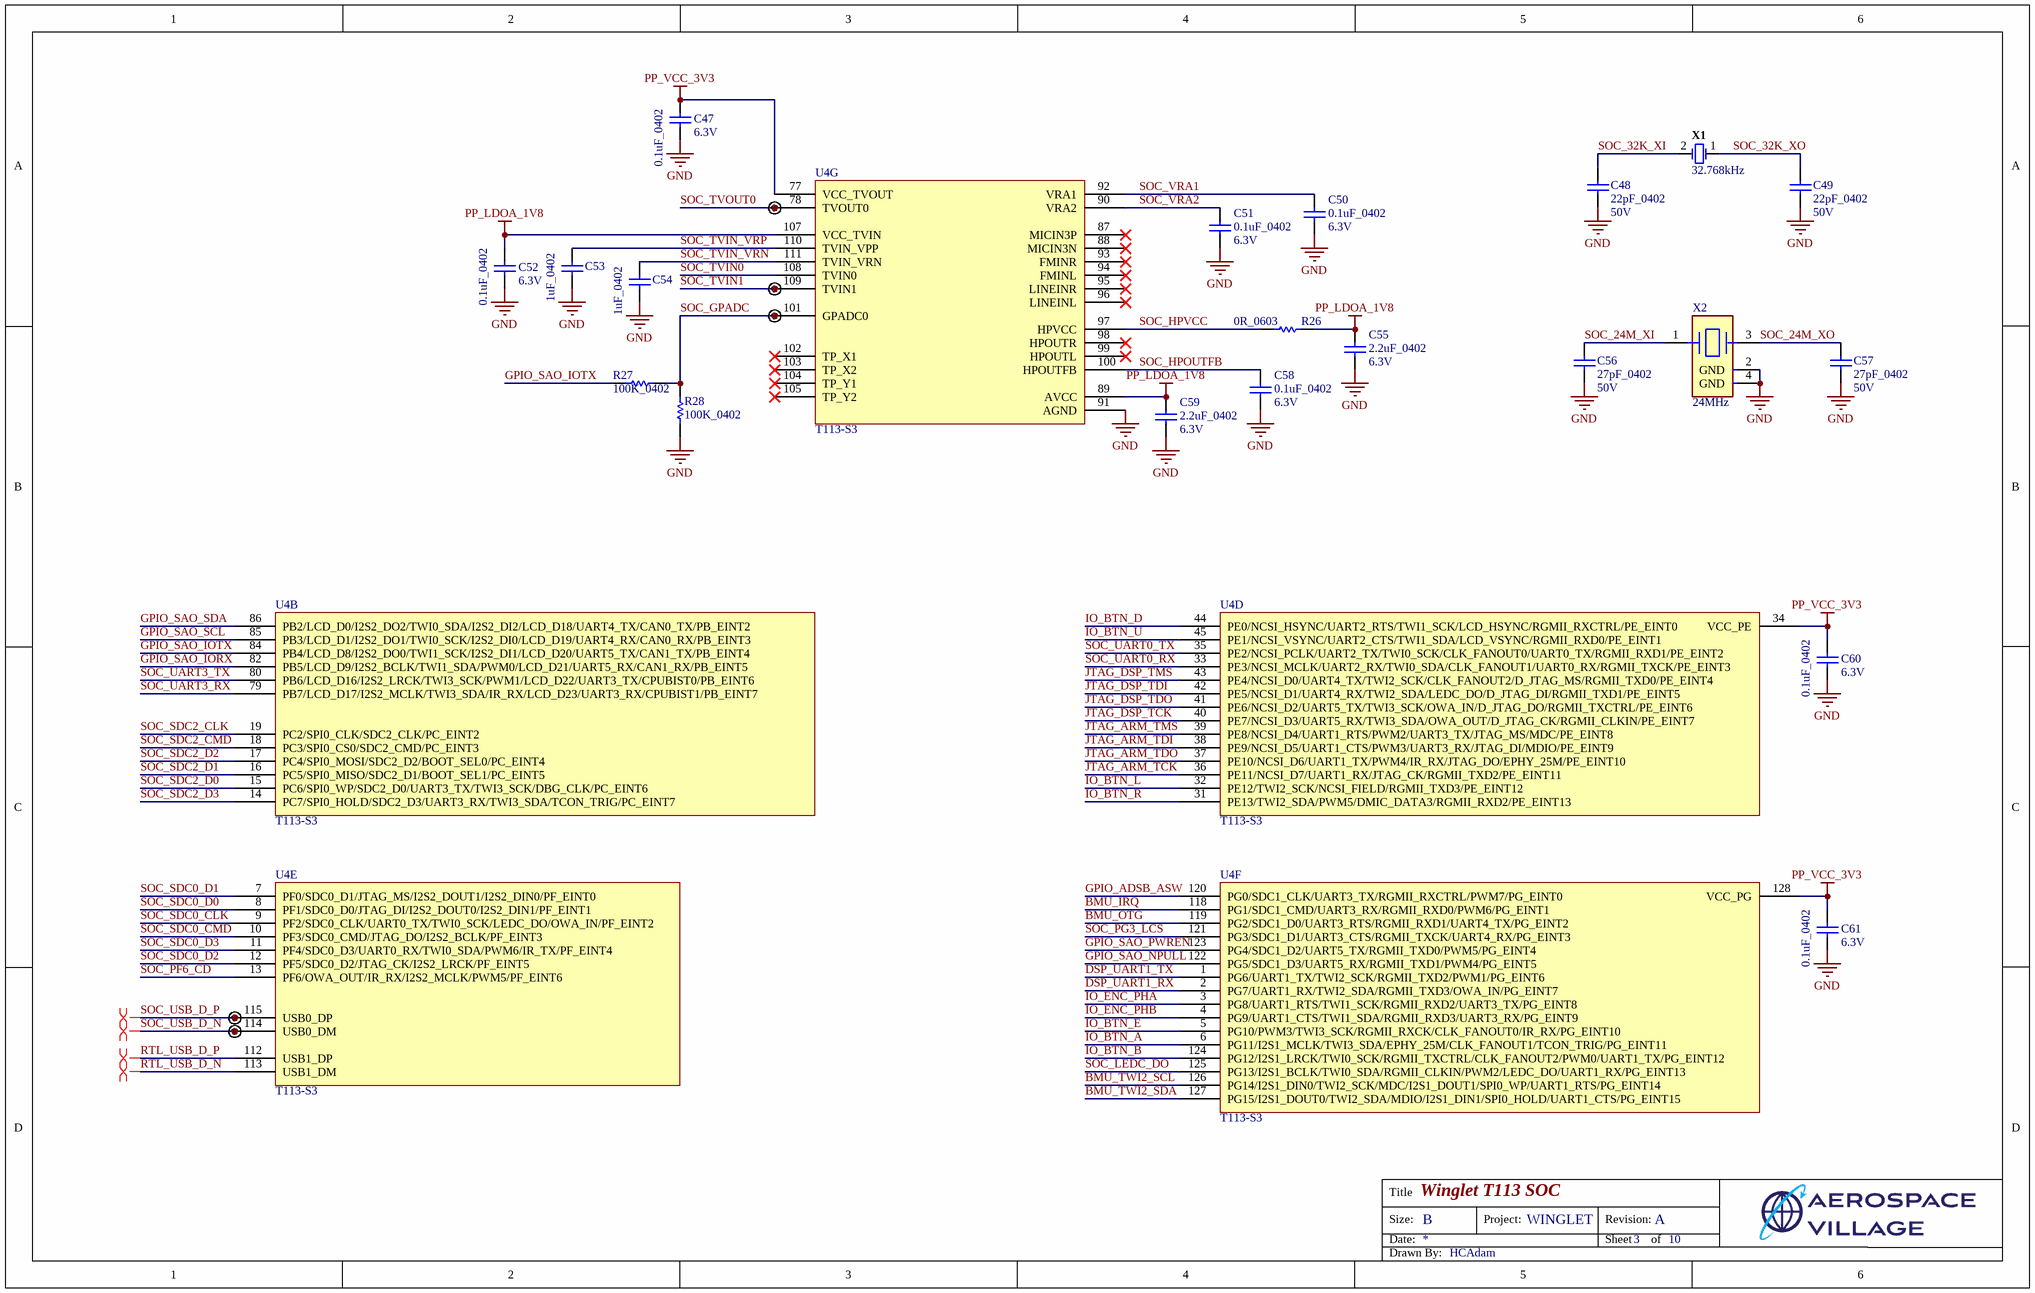
[diagram p2: SCH_WINGLET_SOC.SchDoc]

### Parts
C47  0.1uF_0402  Voltage Rating: 6.3V  [CAPC1005X56X25NL10T15]
C48  22pF_0402  Voltage Rating: 50V  [CAPC1005X56X25LL10T15]
C49  22pF_0402  Voltage Rating: 50V  [CAPC1005X56X25LL10T15]
C50  0.1uF_0402  Voltage Rating: 6.3V  [CAPC1005X56X25NL10T15]
C51  0.1uF_0402  Voltage Rating: 6.3V  [CAPC1005X56X25NL10T15]
C52  0.1uF_0402  Voltage Rating: 6.3V  [CAPC1005X56X25NL10T15]
C53  1uF_0402  [CAPC1005X55X25NL5T10]
C54  1uF_0402  [CAPC1005X55X25NL5T10]
C55  2.2uF_0402  Voltage Rating: 6.3V  [CAPC1005X55X25NL05T10]
C56  27pF_0402  Voltage Rating: 50V  [CAPC1005X55X25ML05T10]
C57  27pF_0402  Voltage Rating: 50V  [CAPC1005X55X25ML05T10]
C58  0.1uF_0402  Voltage Rating: 6.3V  [CAPC1005X56X25NL10T15]
C59  2.2uF_0402  Voltage Rating: 6.3V  [CAPC1005X55X25NL05T10]
C60  0.1uF_0402  Voltage Rating: 6.3V  [CAPC1005X56X25NL10T15]
C61  0.1uF_0402  Voltage Rating: 6.3V  [CAPC1005X56X25NL10T15]
R26  0R_0603  [RESC1608X55X25LL10T15]
R27  100K_0402  [RESC1005X40X25NL05T10]
R28  100K_0402  [RESC1005X40X25NL05T10]
TP7  TESTPOINT  [TESTPOINT-0.7MM-SINGLE-LAYER]  (value not drawn)  (no BOM)
TP8  TESTPOINT  [TESTPOINT-0.7MM-SINGLE-LAYER]  (value not drawn)  (no BOM)
TP9  TESTPOINT  [TESTPOINT-0.7MM-SINGLE-LAYER]  (value not drawn)  (no BOM)
TP10  TESTPOINT  [TESTPOINT-0.7MM-SINGLE-LAYER]  (value not drawn)  (no BOM)
TP11  TESTPOINT  [TESTPOINT-0.7MM-SINGLE-LAYER]  (value not drawn)  (no BOM)
U4  T113-S3  [TSQFP40P1600X1600X160_HS-129N]  (parts B,D,E,F,G of 7)
X1  32.768kHz  [ABRA-ABS07_A_V]
X2  24MHz  [FP-7M-MFG]

### Nets
GND: C47.1 C48.1 C49.1 C50.1 C51.1 C52.1 C53.1 C54.1 C55.1 C56.1 C57.1 C58.1 C59.1 C60.1 C61.1 R28.1 U4.91(AGND) X2.2(GND) X2.4(GND)
PP_LDOA_1V8: C52.2 C55.2 C59.2 R26.1 U4.89(AVCC) U4.107(VCC_TVIN)
PP_VCC_3V3: C47.2 C60.2 C61.2 U4.34(VCC_PE) U4.77(VCC_TVOUT) U4.128(VCC_PG)
BMU_IRQ: U4.118(PG1/SDC1_CMD/UART3_RX/RGMII_RXD0/PWM6/PG_EINT1)
BMU_OTG: U4.119(PG2/SDC1_D0/UART3_RTS/RGMII_RXD1/UART4_TX/PG_EINT2)
BMU_TWI2_SCL: U4.126(PG14/I2S1_DIN0/TWI2_SCK/MDC/I2S1_DOUT1/SPI0_WP/UART1_RTS/PG_EINT14)
BMU_TWI2_SDA: U4.127(PG15/I2S1_DOUT0/TWI2_SDA/MDIO/I2S1_DIN1/SPI0_HOLD/UART1_CTS/PG_EINT15)
DSP_UART1_RX: U4.2(PG7/UART1_RX/TWI2_SDA/RGMII_TXD3/OWA_IN/PG_EINT7)
DSP_UART1_TX: U4.1(PG6/UART1_TX/TWI2_SCK/RGMII_TXD2/PWM1/PG_EINT6)
GPIO_ADSB_ASW: U4.120(PG0/SDC1_CLK/UART3_TX/RGMII_RXCTRL/PWM7/PG_EINT0)
GPIO_SAO_IORX: U4.82(PB5/LCD_D9/I2S2_BCLK/TWI1_SDA/PWM0/LCD_D21/UART5_RX/CAN1_RX/PB_EINT5)
GPIO_SAO_IOTX: R27.2 U4.84(PB4/LCD_D8/I2S2_DO0/TWI1_SCK/I2S2_DI1/LCD_D20/UART5_TX/CAN1_TX/PB_EINT4)
GPIO_SAO_NPULL: U4.122(PG5/SDC1_D3/UART5_RX/RGMII_TXD1/PWM4/PG_EINT5)
GPIO_SAO_PWREN: U4.123(PG4/SDC1_D2/UART5_TX/RGMII_TXD0/PWM5/PG_EINT4)
GPIO_SAO_SCL: U4.85(PB3/LCD_D1/I2S2_DO1/TWI0_SCK/I2S2_DI0/LCD_D19/UART4_RX/CAN0_RX/PB_EINT3)
GPIO_SAO_SDA: U4.86(PB2/LCD_D0/I2S2_DO2/TWI0_SDA/I2S2_DI2/LCD_D18/UART4_TX/CAN0_TX/PB_EINT2)
IO_BTN_A: U4.6(PG11/I2S1_MCLK/TWI3_SDA/EPHY_25M/CLK_FANOUT1/TCON_TRIG/PG_EINT11)
IO_BTN_B: U4.124(PG12/I2S1_LRCK/TWI0_SCK/RGMII_TXCTRL/CLK_FANOUT2/PWM0/UART1_TX/PG_EINT12)
IO_BTN_D: U4.44(PE0/NCSI_HSYNC/UART2_RTS/TWI1_SCK/LCD_HSYNC/RGMII_RXCTRL/PE_EINT0)
IO_BTN_E: U4.5(PG10/PWM3/TWI3_SCK/RGMII_RXCK/CLK_FANOUT0/IR_RX/PG_EINT10)
IO_BTN_L: U4.32(PE12/TWI2_SCK/NCSI_FIELD/RGMII_TXD3/PE_EINT12)
IO_BTN_R: U4.31(PE13/TWI2_SDA/PWM5/DMIC_DATA3/RGMII_RXD2/PE_EINT13)
IO_BTN_U: U4.45(PE1/NCSI_VSYNC/UART2_CTS/TWI1_SDA/LCD_VSYNC/RGMII_RXD0/PE_EINT1)
IO_ENC_PHA: U4.3(PG8/UART1_RTS/TWI1_SCK/RGMII_RXD2/UART3_TX/PG_EINT8)
IO_ENC_PHB: U4.4(PG9/UART1_CTS/TWI1_SDA/RGMII_RXD3/UART3_RX/PG_EINT9)
JTAG_ARM_TCK: U4.36(PE11/NCSI_D7/UART1_RX/JTAG_CK/RGMII_TXD2/PE_EINT11)
JTAG_ARM_TDI: U4.38(PE9/NCSI_D5/UART1_CTS/PWM3/UART3_RX/JTAG_DI/MDIO/PE_EINT9)
JTAG_ARM_TDO: U4.37(PE10/NCSI_D6/UART1_TX/PWM4/IR_RX/JTAG_DO/EPHY_25M/PE_EINT10)
JTAG_ARM_TMS: U4.39(PE8/NCSI_D4/UART1_RTS/PWM2/UART3_TX/JTAG_MS/MDC/PE_EINT8)
JTAG_DSP_TCK: U4.40(PE7/NCSI_D3/UART5_RX/TWI3_SDA/OWA_OUT/D_JTAG_CK/RGMII_CLKIN/PE_EINT7)
JTAG_DSP_TDI: U4.42(PE5/NCSI_D1/UART4_RX/TWI2_SDA/LEDC_DO/D_JTAG_DI/RGMII_TXD1/PE_EINT5)
JTAG_DSP_TDO: U4.41(PE6/NCSI_D2/UART5_TX/TWI3_SCK/OWA_IN/D_JTAG_DO/RGMII_TXCTRL/PE_EINT6)
JTAG_DSP_TMS: U4.43(PE4/NCSI_D0/UART4_TX/TWI2_SCK/CLK_FANOUT2/D_JTAG_MS/RGMII_TXD0/PE_EINT4)
RTL_USB_D_N: U4.113(USB1_DM)
RTL_USB_D_P: U4.112(USB1_DP)
SOC_24M_XI: C56.2 X2.1
SOC_24M_XO: C57.2 X2.3
SOC_32K_XI: C48.2 X1.2
SOC_32K_XO: C49.2 X1.1
SOC_GPADC: R27.1 R28.2 TP9.1 U4.101(GPADC0)
SOC_HPOUTFB: C58.2 U4.100(HPOUTFB)
SOC_HPVCC: R26.2 U4.97(HPVCC)
SOC_LEDC_DO: U4.125(PG13/I2S1_BCLK/TWI0_SDA/RGMII_CLKIN/PWM2/LEDC_DO/UART1_RX/PG_EINT13)
SOC_PF6_CD: U4.13(PF6/OWA_OUT/IR_RX/I2S2_MCLK/PWM5/PF_EINT6)
SOC_PG3_LCS: U4.121(PG3/SDC1_D1/UART3_CTS/RGMII_TXCK/UART4_RX/PG_EINT3)
SOC_SDC0_CLK: U4.9(PF2/SDC0_CLK/UART0_TX/TWI0_SCK/LEDC_DO/OWA_IN/PF_EINT2)
SOC_SDC0_CMD: U4.10(PF3/SDC0_CMD/JTAG_DO/I2S2_BCLK/PF_EINT3)
SOC_SDC0_D0: U4.8(PF1/SDC0_D0/JTAG_DI/I2S2_DOUT0/I2S2_DIN1/PF_EINT1)
SOC_SDC0_D1: U4.7(PF0/SDC0_D1/JTAG_MS/I2S2_DOUT1/I2S2_DIN0/PF_EINT0)
SOC_SDC0_D2: U4.12(PF5/SDC0_D2/JTAG_CK/I2S2_LRCK/PF_EINT5)
SOC_SDC0_D3: U4.11(PF4/SDC0_D3/UART0_RX/TWI0_SDA/PWM6/IR_TX/PF_EINT4)
SOC_SDC2_CLK: U4.19(PC2/SPI0_CLK/SDC2_CLK/PC_EINT2)
SOC_SDC2_CMD: U4.18(PC3/SPI0_CS0/SDC2_CMD/PC_EINT3)
SOC_SDC2_D0: U4.15(PC6/SPI0_WP/SDC2_D0/UART3_TX/TWI3_SCK/DBG_CLK/PC_EINT6)
SOC_SDC2_D1: U4.16(PC5/SPI0_MISO/SDC2_D1/BOOT_SEL1/PC_EINT5)
SOC_SDC2_D2: U4.17(PC4/SPI0_MOSI/SDC2_D2/BOOT_SEL0/PC_EINT4)
SOC_SDC2_D3: U4.14(PC7/SPI0_HOLD/SDC2_D3/UART3_RX/TWI3_SDA/TCON_TRIG/PC_EINT7)
SOC_TVIN0: U4.108(TVIN0)
SOC_TVIN1: TP8.1 U4.109(TVIN1)
SOC_TVIN_VRN: C54.2 U4.111(TVIN_VRN)
SOC_TVIN_VRP: C53.2 U4.110(TVIN_VPP)
SOC_TVOUT0: TP7.1 U4.78(TVOUT0)
SOC_UART0_RX: U4.33(PE3/NCSI_MCLK/UART2_RX/TWI0_SDA/CLK_FANOUT1/UART0_RX/RGMII_TXCK/PE_EINT3)
SOC_UART0_TX: U4.35(PE2/NCSI_PCLK/UART2_TX/TWI0_SCK/CLK_FANOUT0/UART0_TX/RGMII_RXD1/PE_EINT2)
SOC_UART3_RX: U4.79(PB7/LCD_D17/I2S2_MCLK/TWI3_SDA/IR_RX/LCD_D23/UART3_RX/CPUBIST1/PB_EINT7)
SOC_UART3_TX: U4.80(PB6/LCD_D16/I2S2_LRCK/TWI3_SCK/PWM1/LCD_D22/UART3_TX/CPUBIST0/PB_EINT6)
SOC_USB_D_N: TP11.1 U4.114(USB0_DM)
SOC_USB_D_P: TP10.1 U4.115(USB0_DP)
SOC_VRA1: C50.2 U4.92(VRA1)
SOC_VRA2: C51.2 U4.90(VRA2)

Not connected (* = marked no-connect by the designer): U4 87(MICIN3P)* 88(MICIN3N)* 93(FMINR)* 94(FMINL)* 95(LINEINR)* 96(LINEINL)* 98(HPOUTR)* 99(HPOUTL)* 102(TP_X1)* 103(TP_X2)* 104(TP_Y1)* 105(TP_Y2)*

### Layout directives
differential pair: RTL_USB_D_N, RTL_USB_D_P, SOC_USB_D_N, SOC_USB_D_P

### Notes on the sheet
- Title
- Size:
- Date:
- B
- Project:
- Revision:
- Sheet
- of
- Drawn By:

### Library data of the parts
C47 C50-C52 C58 C60 C61 = CMP-2008-02743-1: as C7 on sheet SCH_WINGLET_BMU; Part Number: 04026D104KAT2A
C48 C49 = CMP-2008-02613-1: 04025A220JAT2A; Manufacturer: AVX Interconnect / Elco; Part Number: 04025A220JAT2A
C53 C54 = CMP-1662-00020-1: as C11 on sheet SCH_WINGLET_BMU; ComponentLink2Description: Datasheet; ComponentLink2URL: http://psearch.en.murata.com/capacitor/product/GRM155R60J105KE19%23.pdf; Max Operating Temperature: 85 degC; Min Operating Temperature: -55 degC; Package Quantity: 10000; Mounting Technology: Surface Mount; ComponentLink1Description: Manufacturer URL; ComponentLink1URL: http://www.murata.com/; PackageDescription: 2-Pin Surface Mount Device, Body 1 x 0.5 mm; Tolerance: 10%; Case/Package: 0402; Mount: Surface Mount; Packaging: Tape and Reel; Case Code (Metric): 1005; Radiation Hardening: No; Width: 0.5 mm; Length: 1 mm; DatasheetVersion: 08/2016; Height: 0.5 mm; PartNumber: GRM155R60J105KE19D; RoHSCompliant: true; Case Code (Imperial): 0402; REACH SVHC: No SVHC; Pins: 2
C55 C59 = CMP-2008-04543-1: GRM155R60J225ME15D; Manufacturer: Murata; Part Number: GRM155R60J225ME15D
C56 C57 = CMP-2008-03917-1: GRM1555C1H270JA01D; Manufacturer: Murata; Part Number: GRM1555C1H270JA01D
R26 = CMP-2000-04300-1: RC0603JR-100RL; Manufacturer: Yageo; Part Number: RC0603JR-100RL
R27 R28 = CMP-2002-07343-1: as R12 on sheet SCH_WINGLET_PWR; Part Number: RC0402FR-07100KL
TP7-TP11 = TP_07: as TP1 on sheet SCH_WINGLET_BMU; RoHS: Yes; Package: BOARD_FEATURE; Washable: Yes; Mounting: Unknown
U4 = T113-S3: as U4 on sheet SCH_WINGLET_PWR
X1 = CMP-2000-07587-1: Tuning Fork Crystal, 32.768 KHz, +/- 20 ppm, -40 to 85 degC, 2-Pin SMD, RoHS, Tape and Reel, PN ABS07-120-32.768KHZ-T; Manufacturer: Abracon; Case\/Package: SMD/SMT; Series Resistance: 60KOhm; Frequency Tolerance: 20ppm; Load Capacitance: 6pF; ESR (Equivalent Series Resistance): 55KOhm; Max Operating Temperature: 85degC; Width: 0.061inch; Radiation Hardening: No; Lead Free: LeadFree; RoHSCompliant: True; Depth: 1.5mm; Datasheet URL: http://www.abracon.com/Resonators/ABS07-120-32.768kHz-T.pdf; Frequency: 32.768KHz; Termination: SMD/SMT; Manufacturer URL: http://www.abracon.com/; Package Quantity: 3000; Packaging: TapeandReel; Number of Pins: 2; Height: 0.035inch; Package Description: 2-Pin Surface Mount Device, Body 3.2 x 1.5 mm; Package Reference: ABS07; Mount: SurfaceMount; Tolerance: 20ppm; Mounting Technology: SurfaceMount; REACH SVHC: NoSVHC; Datasheet Version: 11/2014; Length: 3.2mm; Min Operating Temperature: -40degC
X2 = CMP-18717-000454-1: Crystal 24MHz, 30ppm, 12pF, 50Ω / 7M-24.000MAAE-T; ESR (Equivalent Series Resistance): 60R; Length: 0.126inch; Frequency Stability: 30ppm; Series: 7M; Max Operating Temperature: 70°C; Load Capacitance: 12pF; Width: 0.098inch; Frequency Tolerance: 30ppm; Min Operating Temperature: -20°C; Mount: Surface Mount; Package Quantity: 3000; REACH SVHC: No SVHC; Case/Package: SMD/SMT; Depth: 2.5mm; Height: 0.031inch; Frequency: 24MHz; Packaging: Tape and Reel; Number of Pins: 4

## Sheet SCH_WINGLET_SD_MMC.SchDoc: Winglet MicroSD & eMMC
size B; DrawnBy: HCAdam; Organization: Aerospace Village; DocumentNumber: WINGLET; Revision: A; SheetNumber: 4; SheetTotal: 10
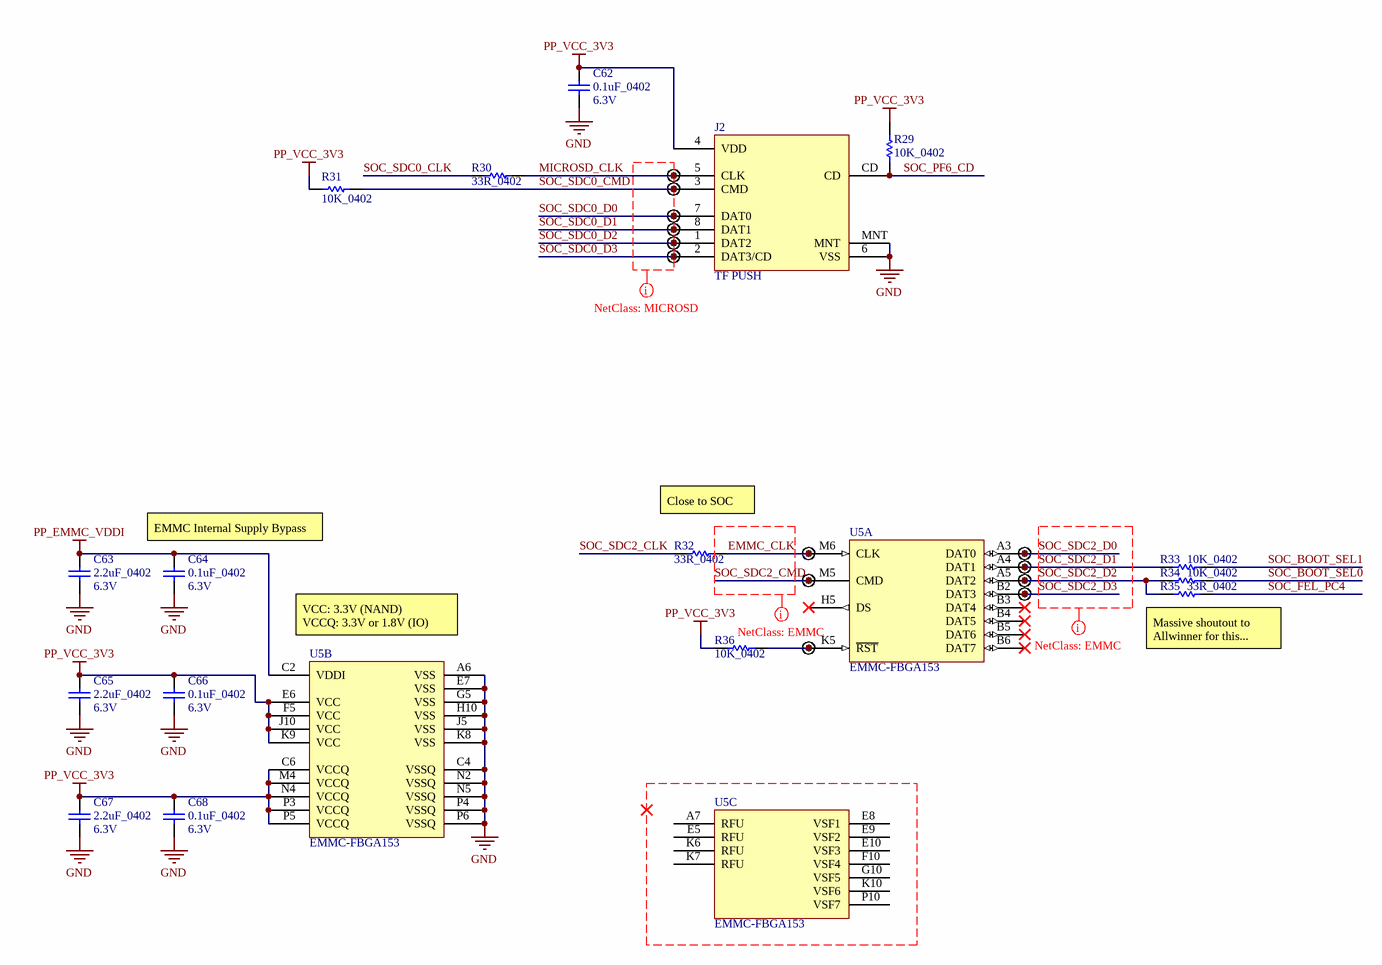
[diagram p3: SCH_WINGLET_SD_MMC.SchDoc]

### Parts
C62  0.1uF_0402  Voltage Rating: 6.3V  [CAPC1005X56X25NL10T15]
C63  2.2uF_0402  Voltage Rating: 6.3V  [CAPC1005X55X25NL05T10]
C64  0.1uF_0402  Voltage Rating: 6.3V  [CAPC1005X56X25NL10T15]
C65  2.2uF_0402  Voltage Rating: 6.3V  [CAPC1005X55X25NL05T10]
C66  0.1uF_0402  Voltage Rating: 6.3V  [CAPC1005X56X25NL10T15]
C67  2.2uF_0402  Voltage Rating: 6.3V  [CAPC1005X55X25NL05T10]
C68  0.1uF_0402  Voltage Rating: 6.3V  [CAPC1005X56X25NL10T15]
J2  TF PUSH  [LCSC_TF_PUSH]
R29  10K_0402  [RESC1005X40X25NL05T05]
R30  33R_0402  [RESC1005X40X25NL05T05]
R31  10K_0402  [RESC1005X40X25NL05T05]
R32  33R_0402  [RESC1005X40X25NL05T05]
R33  10K_0402  [RESC1005X40X25NL05T05]
R34  10K_0402  [RESC1005X40X25NL05T05]
R35  33R_0402  [RESC1005X40X25NL05T05]
R36  10K_0402  [RESC1005X40X25NL05T05]
TP12  TESTPOINT  [TESTPOINT-0.7MM-SINGLE-LAYER]  (value not drawn)  (no BOM)
TP13  TESTPOINT  [TESTPOINT-0.7MM-SINGLE-LAYER]  (value not drawn)  (no BOM)
TP14  TESTPOINT  [TESTPOINT-0.7MM-SINGLE-LAYER]  (value not drawn)  (no BOM)
TP15  TESTPOINT  [TESTPOINT-0.7MM-SINGLE-LAYER]  (value not drawn)  (no BOM)
TP16  TESTPOINT  [TESTPOINT-0.7MM-SINGLE-LAYER]  (value not drawn)  (no BOM)
TP17  TESTPOINT  [TESTPOINT-0.7MM-SINGLE-LAYER]  (value not drawn)  (no BOM)
TP18  TESTPOINT  [TESTPOINT-0.7MM-SINGLE-LAYER]  (value not drawn)  (no BOM)
TP19  TESTPOINT  [TESTPOINT-0.7MM-SINGLE-LAYER]  (value not drawn)  (no BOM)
TP20  TESTPOINT  [TESTPOINT-0.7MM-SINGLE-LAYER]  (value not drawn)  (no BOM)
TP21  TESTPOINT  [TESTPOINT-0.7MM-SINGLE-LAYER]  (value not drawn)  (no BOM)
TP22  TESTPOINT  [TESTPOINT-0.7MM-SINGLE-LAYER]  (value not drawn)  (no BOM)
TP23  TESTPOINT  [TESTPOINT-0.7MM-SINGLE-LAYER]  (value not drawn)  (no BOM)
TP24  TESTPOINT  [TESTPOINT-0.7MM-SINGLE-LAYER]  (value not drawn)  (no BOM)
U5  EMMC-FBGA153  [BGA153C50P14X14_1150X1300X100]  (parts A,B,C of 3)

### Nets
GND: C62.1 C63.1 C64.1 C65.1 C66.1 C67.1 C68.1 J2.6(VSS) J2.MNT U5.A6(VSS) U5.C4(VSSQ) U5.E7(VSS) U5.G5(VSS) U5.H10(VSS) U5.J5(VSS) U5.K8(VSS) U5.N2(VSSQ) U5.N5(VSSQ) U5.P4(VSSQ) U5.P6(VSSQ)
PP_EMMC_VDDI: C63.2 C64.2 U5.C2(VDDI)
PP_VCC_3V3: C62.2 C65.2 C66.2 C67.2 C68.2 J2.4(VDD) R29.1 R31.1 R36.2 U5.C6(VCCQ) U5.E6(VCC) U5.F5(VCC) U5.J10(VCC) U5.K9(VCC) U5.M4(VCCQ) U5.N4(VCCQ) U5.P3(VCCQ) U5.P5(VCCQ)
EMMC_CLK: R32.2 TP18.1 U5.M6(CLK)
MICROSD_CLK: J2.5(CLK) R30.2 TP12.1
SOC_BOOT_SEL0: R34.2
SOC_BOOT_SEL1: R33.2
SOC_FEL_PC4: R35.2
SOC_PF6_CD: J2.CD R29.2
SOC_SDC0_CLK: R30.1
SOC_SDC0_CMD: J2.3(CMD) R31.2 TP13.1
SOC_SDC0_D0: J2.7(DAT0) TP14.1
SOC_SDC0_D1: J2.8(DAT1) TP15.1
SOC_SDC0_D2: J2.1(DAT2) TP16.1
SOC_SDC0_D3: J2.2(DAT3/CD) TP17.1
SOC_SDC2_CLK: R32.1
SOC_SDC2_CMD: TP21.1 U5.M5(CMD)
SOC_SDC2_D0: TP19.1 U5.A3(DAT0)
SOC_SDC2_D1: R33.1 TP20.1 U5.A4(DAT1)
SOC_SDC2_D2: R34.1 R35.1 TP22.1 U5.A5(DAT2)
SOC_SDC2_D3: TP23.1 U5.B2(DAT3)
NetR36_1: R36.1 TP24.1 U5.K5(~{RST})

Not connected (* = marked no-connect by the designer): U5 A7(RFU) B3(DAT4)* B4(DAT5)* B5(DAT6)* B6(DAT7)* E5(RFU) E8(VSF1) E9(VSF2) E10(VSF3) F10(VSF4) G10(VSF5) H5(DS)* K6(RFU) K7(RFU) K10(VSF6) P10(VSF7)

### Layout directives
net class MICROSD: (no net found under the mark)
net class EMMC: EMMC_CLK, SOC_SDC2_CMD, SOC_SDC2_D0, SOC_SDC2_D1, SOC_SDC2_D2, SOC_SDC2_D3

### Notes on the sheet
- (near C64) EMMC Internal Supply Bypass
- (near R32) Close to SOC
- (near U5) VCC: 3.3V (NAND)
  VCCQ: 3.3V or 1.8V (IO)
- (near R35) Massive shoutout to Allwinner for this...
- Title
- Size:
- Date:
- B
- Project:
- Revision:
- Sheet
- of
- Drawn By:

### Library data of the parts
C62 C64 C66 C68 = CMP-2008-02743-1: as C7 on sheet SCH_WINGLET_BMU; Part Number: 04026D104KAT2A
C63 C65 C67 = CMP-2008-04543-1: GRM155R60J225ME15D; Manufacturer: Murata; Part Number: GRM155R60J225ME15D
J2 = SDCARD_TF_PUSH: MicroSD Card Slot Push-Pull
R29 R31 R33 R34 R36 = CMP-2000-07588-1: as R1 on sheet SCH_WINGLET_BMU; RoHSCompliant: True; Lead Free: LeadFree; Package Quantity: 1; Contact Plating: Tin; Length: 1mm; Radiation Hardening: No; REACH SVHC: NoSVHC; Max Operating Temperature: 155degC; Depth: 0.5mm; Case Code (Imperial): 0402; Military Standard: Not; Package Description: 2-Pin Surface Mount Device, Body 1 x 0.5 mm; Termination: SMD/SMT; Case Code (Metric): 1005; Height: 0.35mm; Packaging: TapeandReel; Voltage Rating (DC): 50V; Package Reference: 402; Number of Pins: 2; Tolerance: 1%; Mounting Technology: SurfaceMount; Width: 0.02inch; Mount: SurfaceMount; Datasheet URL: https://industrial.panasonic.com/cdbs/www-data/pdf/RDA0000/AOA0000C304.pdf; Composition: ThickFilm; Datasheet Version: 02/2017; Manufacturer URL: http://www.panasonic.com/; Max Power Dissipation: 100mW; Number of Terminations: 2; Min Operating Temperature: -55degC
R30 R32 R35 = CMP-2002-01146-1: ERJ2RKF33R0X; Manufacturer: Panasonic; Part Number: ERJ2RKF33R0X
TP12-TP24 = TP_07: as TP1 on sheet SCH_WINGLET_BMU; RoHS: Yes; Package: BOARD_FEATURE; Washable: Yes; Mounting: Unknown
U5 = EMMC-FBGA153: FLASH - NAND (MLC) Memory IC 32Gb (4G x 8) eMMC 5.1 153-FBGA (11.5x13)